# Altium schematic sheet PCIe_MUX_CLK.SchDoc
size 420 x 297 mm; SheetNumber: 10; SheetTotal: 11; ModifiedBy: -; CheckedDate: -; Title2: Title 2; DivGrp: WUT ISE; Designer: G.Kasprowicz
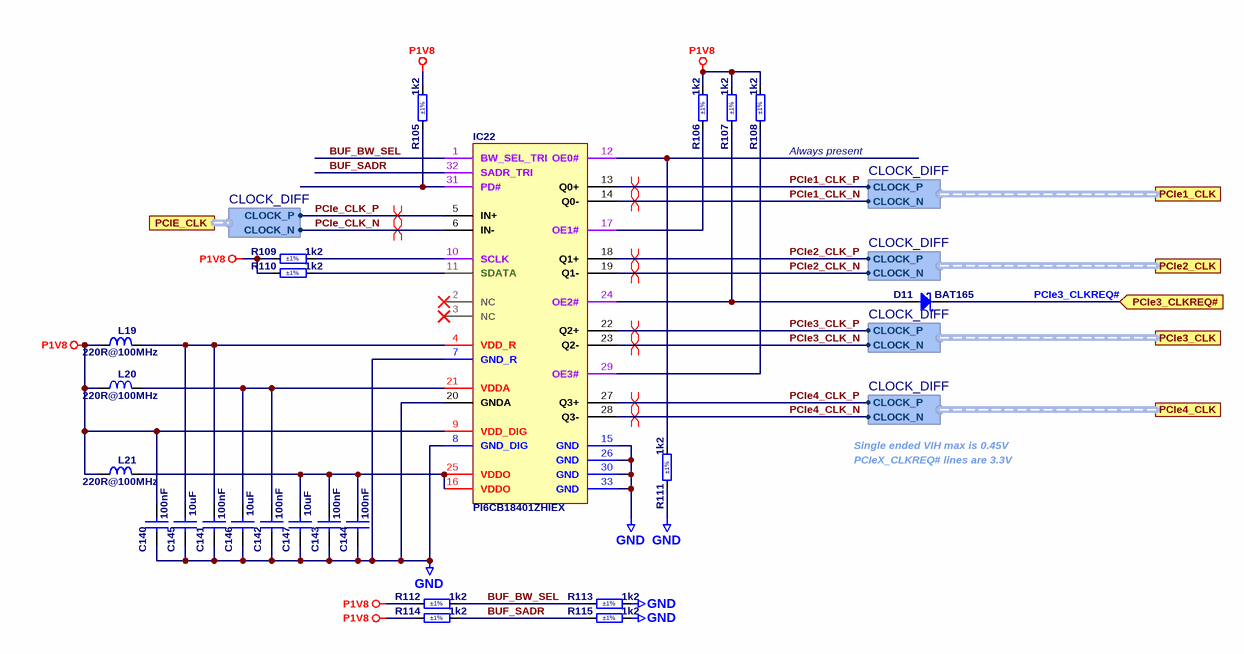
[diagram p0: PCIe_MUX_CLK.SchDoc]

## Parts
C140  100nF  [CAPC1005X55N]
C141  100nF  [CAPC1005X55N]
C142  100nF  [CAPC1005X55N]
C143  100nF  [CAPC1005X55N]
C144  100nF  [CAPC1005X55N]
C145  10uF  [CAPC1608X80N]
C146  10uF  [CAPC1608X80N]
C147  10uF  [CAPC1608X80N]
D11  BAT165  [SOD2512X110N]
IC22  PI6CB18401ZHIEX  [PERICOM_32-TQFN(ZH)]
L19  220R@100MHz  [INDC2012X105N]
L20  220R@100MHz  [INDC2012X105N]
L21  220R@100MHz  [INDC2012X105N]
R105  1k2  Tolerance: ±1%  [RESC1005X40N]
R106  1k2  Tolerance: ±1%  [RESC1005X40N]
R107  1k2  Tolerance: ±1%  [RESC1005X40N]
R108  1k2  Tolerance: ±1%  [RESC1005X40N]
R109  1k2  Tolerance: ±1%  [RESC1005X40N]
R110  1k2  Tolerance: ±1%  [RESC1005X40N]
R111  1k2  Tolerance: ±1%  [RESC1005X40N]
R112  1k2  Tolerance: ±1%  [RESC1005X40N]
R113  1k2  Tolerance: ±1%  [RESC1005X40N]
R114  1k2  Tolerance: ±1%  [RESC1005X40N]
R115  1k2  Tolerance: ±1%  [RESC1005X40N]

## Ports
PCIe1_CLK (harness CLOCK_DIFF), PCIe2_CLK (harness CLOCK_DIFF), PCIe3_CLK (harness CLOCK_DIFF), PCIe3_CLKREQ# (in), PCIe4_CLK (harness CLOCK_DIFF), PCIE_CLK (harness CLOCK_DIFF)

## Harnesses
CLOCK_DIFF: CLOCK_P, CLOCK_N

## Nets
GND: C140.1 C141.1 C142.1 C143.1 C144.1 C145.1 C146.1 C147.1 IC22.7(GND_R) IC22.8(GND_DIG) IC22.15(GND) IC22.20(GNDA) IC22.26(GND) IC22.30(GND) IC22.33(GND) R111.1 R113.2 R115.2
P1V8: C140.2 IC22.9(VDD_DIG) L19.1 L20.1 L21.1 R105.2 R106.2 R107.2 R108.2 R109.1 R110.1 R112.1 R114.1
BUF_BW_SEL: IC22.1(BW_SEL_TRI) R112.2 R113.1
BUF_SADR: IC22.32(SADR_TRI) R114.2 R115.1
PCIe1_CLK_N: IC22.14(Q0-) ; port PCIe1_CLK.CLOCK_N
PCIe1_CLK_P: IC22.13(Q0+) ; port PCIe1_CLK.CLOCK_P
PCIe2_CLK_N: IC22.19(Q1-) ; port PCIe2_CLK.CLOCK_N
PCIe2_CLK_P: IC22.18(Q1+) ; port PCIe2_CLK.CLOCK_P
PCIe3_CLK_N: IC22.23(Q2-) ; port PCIe3_CLK.CLOCK_N
PCIe3_CLK_P: IC22.22(Q2+) ; port PCIe3_CLK.CLOCK_P
PCIe3_CLKREQ#: D11.1(C) ; port PCIe3_CLKREQ#
PCIe4_CLK_N: IC22.28(Q3-) ; port PCIe4_CLK.CLOCK_N
PCIe4_CLK_P: IC22.27(Q3+) ; port PCIe4_CLK.CLOCK_P
PCIe_CLK_N: IC22.6(IN-) ; port PCIE_CLK.CLOCK_N
PCIe_CLK_P: IC22.5(IN+) ; port PCIE_CLK.CLOCK_P
NetC141_2: C141.2 C145.2 IC22.4(VDD_R) L19.2
NetC142_2: C142.2 C146.2 IC22.21(VDDA) L20.2
NetC143_2: C143.2 C144.2 C147.2 IC22.16(VDDO) IC22.25(VDDO) L21.2
NetD11_2: D11.2(A) IC22.24(OE2#) R107.1
NetIC22_10: IC22.10(SCLK) R109.2
NetIC22_11: IC22.11(SDATA) R110.2
NetIC22_12: IC22.12(OE0#) R111.2
NetIC22_17: IC22.17(OE1#) R106.1
NetIC22_29: IC22.29(OE3#) R108.1
NetIC22_31: IC22.31(PD#) R105.1

Not connected (* = marked no-connect by the designer): IC22 2(NC)* 3(NC)*

## Layout directives
differential pair: PCIe1_CLK_N, PCIe1_CLK_P, PCIe2_CLK_N, PCIe2_CLK_P, PCIe3_CLK_N, PCIe3_CLK_P, PCIe4_CLK_N, PCIe4_CLK_P, PCIe_CLK_N, PCIe_CLK_P

## Notes on the sheet
- (near R108) Always present
- Single ended VIH max is 0.45V
- PCIeX_CLKREQ# lines are 3.3V
- Project/Equipment
- Document
- Designer
- Drawn by
- Check.by
- Copyright WUT ISE 2024.
  This documentation describes Open Hardware and is licensed under the CERN OHL v.2. You may redistribute and modify this documentation under the terms of the CERN OHL v.2. (http://ohwr.org/CERNOHL). This documentation is distributed WITHOUT ANY EXPRESS OR IMPLIED WARRANTY, INCLUDING OF MERCHANTABILITY, SATISFACTORY QUALITY AND FITNESS FOR A PARTICULAR PURPOSE. Please see the CERN OHL v.2 for applicable conditions.
- Contact
- File
- Last Mod.
- Print Date
- Sheet
- Size
- A3
- of
- Rev

## Library data of the parts
C140-C144 = CC0402_100NF_16V_10%_X7R: Non-polarised capacitor; Part Description: SMD Multilayer Chip Ceramic Capacitor; Manufacturer: GENERIC; Manufacturer1 Part Number: GRM155R71C104KA88D; Voltage: 16V; TC: X7R; Tolerance: ±10%; Part Number: CC0402_100NF_16V_10%_X7R; Component Kind: Standard; Component Type: Standard; Pin Count: 2; Value: 100nF; Status: Not Recommended; Manufacturer Part Number: CC0402_100NF_16V_10%_X7R; Case: 0402; Mounted: Yes; Socket: No; SMD: Yes; Sense: No; Manufacturer1 Example: MURATA; Manufacturer1 ComponentHeight: 0.55mm; HelpURL: \\cern.ch\dfs\Applications\Altium\Datasheets\CC0402_X7R_MURATA_GRM.pdf; Author: CERN DEM JLC; CreateDate: 05/12/2013; LatestRevisionDate: 03/12/2007
C145-C147 = CC0603_10UF_16V_20%_X5R: Non-polarised capacitor; Part Description: SMD Multilayer Chip Ceramic Capacitor; Manufacturer: GENERIC; Manufacturer1 Part Number: GRM188R61C106MA73D; Voltage: 16V; TC: X5R; Tolerance: ±20%; Part Number: CC0603_10UF_16V_20%_X5R; Component Kind: Standard; Component Type: Standard; Pin Count: 2; Value: 10uF; Status: None; Manufacturer Part Number: CC0603_10UF_16V_20%_X5R; Case: 0603; Mounted: Yes; Socket: No; SMD: Yes; Sense: No; Manufacturer1 Example: MURATA; Manufacturer1 ComponentHeight: 0.8mm; HelpURL: \\cern.ch\dfs\Applications\Altium\Datasheets\CC0603_X5R_MURATA_GRM.pdf; Author: CERN DEM MR; CreateDate: 02.03.2016; LatestRevisionDate: 02.03.2016
D11 = BAT165: Schottky Diode; Part Description: Medium Power AF Schottky Diode; Manufacturer: INFINEON; Voltage: 40V; Power: 750mA; PressFit: No; Bonding: No; Part Number: BAT165; Component Kind: Standard; Component Type: Standard; Device: BAT165; PackageDescription: Small Outline Diode (SOD-323), 1.70mm W X 1.25mm L X 1.10mm H body,  IPC Medium Density; Manufacturer Part Number: BAT165; Pin Count: 2; Case: SOD-323; Mounted: Yes; Socket: No; SMD: Yes; Sense: No; ComponentHeight: 1.1mm; HelpURL: \\cern.ch\dfs\Applications\Altium\Datasheets\BAT165.pdf; Author: CERN DEM JLC; CreateDate: 12.11.2014; LatestRevisionDate: 12.11.2014
IC22 = PI6CB18401: Very Low Power 4-Output PCIe Clock Buffer With On-chip Termination
L19-L21 = IND0805_MURATA_BLM21PG221SN1D: Inductor; Part Description: SMD EMIFIL Suppression Chip Bead Ferrite; Manufacturer: MURATA; Power: 2A; Resistance: 0.05R; Tolerance: ±25%; Table: Inductors SMD; Part Number: IND0805_MURATA_BLM21PG221SN1D; Component Kind: Standard; Component Type: Standard; Pin Count: 2; Value: 220R@100MHz; Status: None; Manufacturer Part Number: BLM21PG221SN1D; Case: 0805; Mounted: Yes; Socket: No; SMD: Yes; ComponentHeight: 1.05mm; HelpURL: \\cern.ch\dfs\Applications\Altium\Datasheets\IND0402_MURATA_BLM21P.pdf; Author: CERN DEM JLC; CreateDate: 25/01/2010; LatestRevisionDate: 25/01/2010
R105-R115 = R0402_1K2_1%_0.0625W_100PPM: Resistor - 1%; Part Description: General Purpose Thick Film Chip Resistor; Manufacturer: GENERIC; Manufacturer 1: YAGEO PHYCOMP; Manufacturer 1 Part Number: 232270671202L; TC: ±100ppm/°C; PressFit: No; Part Number: R0402_1K2_1%_0.0625W_100PPM; Component Kind: Standard; Component Type: Standard; Pin Count: 2; Value: 1k2; Status: Not Recommended; Power: 0.0625W; Manufacturer Part Number: R0402_1K2_1%_0.0625W_100PPM; Case: 0402; Mounted: Yes; Sense: No; Socket: No; SMD: Yes; Manufacturer1 ComponentHeight: 0.4mm; HelpURL: \\cern.ch\dfs\Applications\Altium\Datasheets\R0402_Phycomp_RC0402.pdf; Author: CERN DEM JLC; CreateDate: 03.12.2007; LatestRevisionDate: 17.10.2012